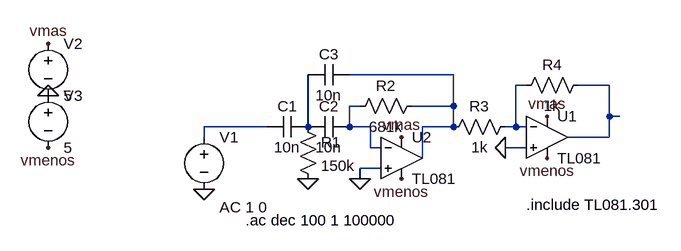
[diagram p0: schematic TP.asc]
TP.asc, the LTspice schematic file:
Version 4
SHEET 1 880 680
WIRE 144 80 -16 80
WIRE 256 96 240 96
WIRE 384 96 336 96
WIRE 0 128 -16 128
WIRE 144 128 144 80
WIRE 144 128 80 128
WIRE 384 144 384 96
WIRE 400 144 384 144
WIRE -144 160 -240 160
WIRE -80 160 -80 80
WIRE -16 160 -16 128
WIRE 16 160 -16 160
WIRE 144 160 144 128
WIRE 144 160 96 160
WIRE 240 160 240 96
WIRE 240 160 224 160
WIRE 256 160 240 160
WIRE -240 176 -240 160
WIRE 384 176 384 144
WIRE 384 176 320 176
WIRE 16 192 16 160
WIRE 32 192 16 192
WIRE 256 192 224 192
WIRE 96 208 96 160
WIRE 32 224 0 224
WIRE 0 240 0 224
FLAG -80 240 0
FLAG 0 240 0
FLAG 224 192 0
FLAG -240 256 0
FLAG -480 112 0
FLAG -480 32 vmas
FLAG 288 144 vmas
FLAG -480 192 vmenos
FLAG 288 208 vmenos
FLAG 64 176 vmas
FLAG 64 240 vmenos
SYMBOL cap -80 144 R90
WINDOW 0 0 32 VBottom 2
WINDOW 3 32 32 VTop 2
SYMATTR InstName C1
SYMATTR Value 10n
SYMBOL res -96 144 R0
SYMATTR InstName R1
SYMATTR Value 150k
SYMBOL cap -16 144 R90
WINDOW 0 0 32 VBottom 2
WINDOW 3 32 32 VTop 2
SYMATTR InstName C2
SYMATTR Value 10n
SYMBOL cap -16 64 R90
WINDOW 0 0 32 VBottom 2
WINDOW 3 32 32 VTop 2
SYMATTR InstName C3
SYMATTR Value 10n
SYMBOL res 96 112 R90
WINDOW 0 0 56 VBottom 2
WINDOW 3 32 56 VTop 2
SYMATTR InstName R2
SYMATTR Value 681k
SYMBOL res 240 144 R90
WINDOW 0 0 56 VBottom 2
WINDOW 3 32 56 VTop 2
SYMATTR InstName R3
SYMATTR Value 1k
SYMBOL res 352 80 R90
WINDOW 0 0 56 VBottom 2
WINDOW 3 32 56 VTop 2
SYMATTR InstName R4
SYMATTR Value 1k
SYMBOL Opamps\\opamp2 288 112 R0
SYMATTR InstName U1
SYMATTR Value TL081
SYMATTR SpiceModel TL081
SYMBOL Opamps\\opamp2 64 144 R0
SYMATTR InstName U2
SYMATTR Value TL081
SYMATTR SpiceModel TL081
SYMBOL voltage -240 160 R0
WINDOW 123 24 124 Left 2
WINDOW 39 0 0 Left 0
SYMATTR Value2 AC 1 0
SYMATTR InstName V1
SYMATTR Value ""
SYMBOL voltage -480 16 R0
WINDOW 123 0 0 Left 0
WINDOW 39 0 0 Left 0
SYMATTR InstName V2
SYMATTR Value 5
SYMBOL voltage -480 96 R0
WINDOW 123 0 0 Left 0
WINDOW 39 0 0 Left 0
SYMATTR InstName V3
SYMATTR Value 5
TEXT 256 280 Left 2 !.include TL081.301
TEXT -176 304 Left 2 !.ac dec 100 1 100000

The netlist it stands for:
* TP.asc
C1 N006 N005 10n
R1 N006 0 150k
C2 N004 N006 10n
C3 N001 N006 10n
R2 N001 N004 681k
R3 N002 N001 1k
R4 N003 N002 1k
XU1 0 N002 vmas vmenos N003 TL081 TL081  ; pins In+ In- V+ V- OUT
XU2 0 N004 vmas vmenos N001 TL081 TL081  ; pins In+ In- V+ V- OUT
V1 N005 0 AC 1 0
V2 vmas 0 5
V3 0 vmenos 5
.include TL081.301
.ac dec 100 1 100000
.backanno
.end